# EAGLE schematic Ex Pin Expander (EAGLE 7.2.0)
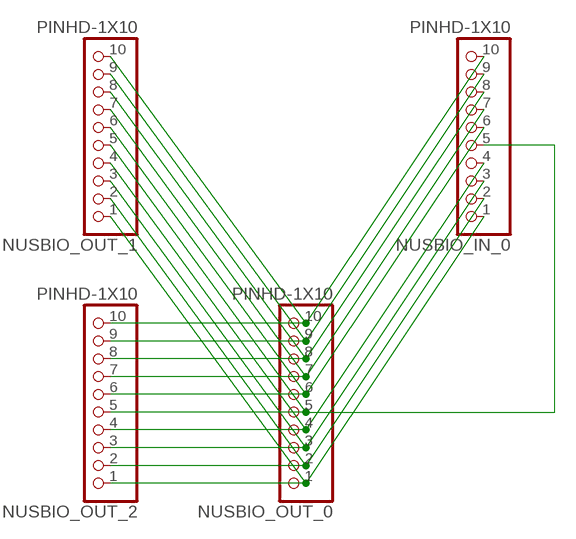
[diagram p0: schematic, sheet 1]

## Parts
NUSBIO_IN_0  PINHD-1X10  [1X10-BIG]
NUSBIO_OUT_0  PINHD-1X10  [1X10-BIG]
NUSBIO_OUT_1  PINHD-1X10  [1X10-BIG]
NUSBIO_OUT_2  PINHD-1X10  [1X10-BIG]

## Nets
N$1: NUSBIO_IN_0.10 NUSBIO_OUT_0.10 NUSBIO_OUT_1.10 NUSBIO_OUT_2.10
N$2: NUSBIO_IN_0.9 NUSBIO_OUT_0.9 NUSBIO_OUT_1.9 NUSBIO_OUT_2.9
N$3: NUSBIO_IN_0.8 NUSBIO_OUT_0.8 NUSBIO_OUT_1.8 NUSBIO_OUT_2.8
N$4: NUSBIO_IN_0.7 NUSBIO_OUT_0.7 NUSBIO_OUT_1.7 NUSBIO_OUT_2.7
N$5: NUSBIO_IN_0.6 NUSBIO_OUT_0.6 NUSBIO_OUT_1.6 NUSBIO_OUT_2.6
N$6: NUSBIO_IN_0.5 NUSBIO_OUT_0.5 NUSBIO_OUT_1.5 NUSBIO_OUT_2.5
N$7: NUSBIO_IN_0.4 NUSBIO_OUT_0.4 NUSBIO_OUT_1.4 NUSBIO_OUT_2.4
N$8: NUSBIO_IN_0.3 NUSBIO_OUT_0.3 NUSBIO_OUT_1.3 NUSBIO_OUT_2.3
N$9: NUSBIO_IN_0.2 NUSBIO_OUT_0.2 NUSBIO_OUT_1.2 NUSBIO_OUT_2.2
N$10: NUSBIO_IN_0.1 NUSBIO_OUT_0.1 NUSBIO_OUT_1.1 NUSBIO_OUT_2.1

## Library data of the parts
NUSBIO_IN_0 NUSBIO_OUT_0 NUSBIO_OUT_1 NUSBIO_OUT_2 = adafruit:PINHD-1X10: Pin header 1x10 0.1" spacing With round pins